# Altium schematic sheet [08] - DDR3 MEMORY.SchDoc
size A2; DocumentNumber: 8; SheetNumber: 8; SheetTotal: 13; NameAuthor: Angle Vu
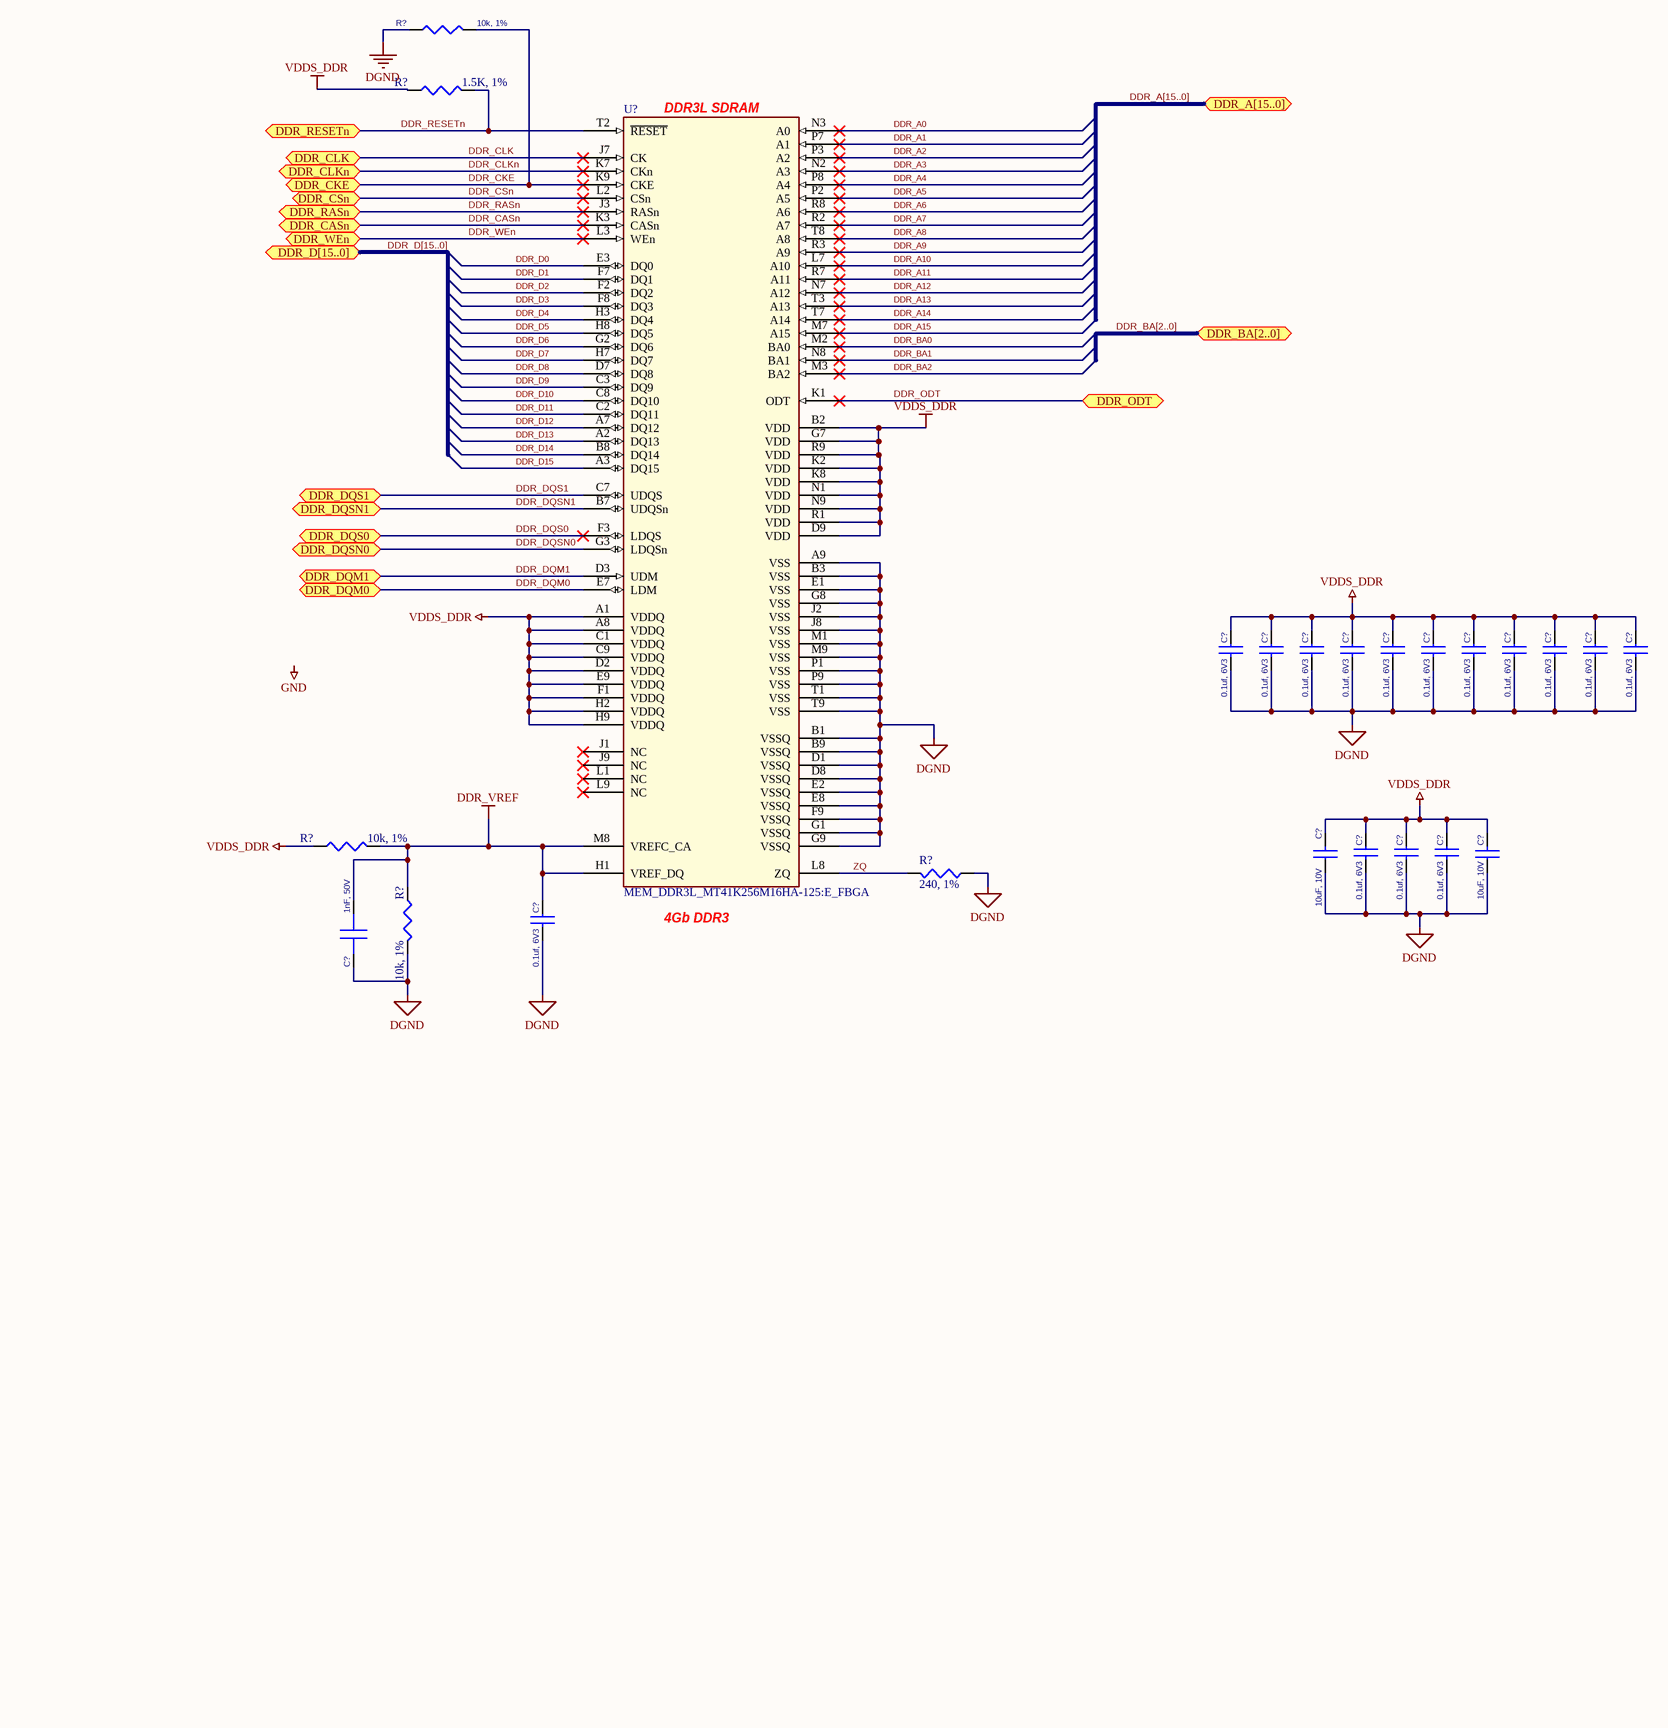
[diagram p0: [08] - DDR3 MEMORY.SchDoc]

## Parts
(Parts that share a designator on the sheet are numbered #1, #2 ... from top to bottom, then left to right.)
C?#1  0.1uf, 6V3  [402]
C?#2  0.1uf, 6V3  [402]
C?#3  0.1uf, 6V3  [402]
C?#4  0.1uf, 6V3  [402]
C?#5  0.1uf, 6V3  [402]
C?#6  0.1uf, 6V3  [402]
C?#7  0.1uf, 6V3  [402]
C?#8  0.1uf, 6V3  [402]
C?#9  0.1uf, 6V3  [402]
C?#10  0.1uf, 6V3  [402]
C?#11  0.1uf, 6V3  [402]
C?#12  0.1uf, 6V3  [402]
C?#13  0.1uf, 6V3  [402]
C?#14  0.1uf, 6V3  [402]
C?#15  10uF, 10V  [805]
C?#16  10uF, 10V  [805]
C?#17  1nF, 50V  [402]
C?#18  0.1uf, 6V3  [402]
R?#1  10k, 1%  [402]
R?#2  1.5K, 1%  [402]
R?#3  10k, 1%  [402]
R?#4  240, 1%  [402]
R?#5  10k, 1%  [402]
U?  MEM_DDR3L_MT41K256M16HA-125:E_FBGA

## Ports
DDR_A[15..0], DDR_BA[2..0], DDR_CASn, DDR_CKE, DDR_CLK, DDR_CLKn, DDR_CSn, DDR_D[15..0], DDR_DQM0, DDR_DQM1, DDR_DQS0, DDR_DQS1, DDR_DQSN0, DDR_DQSN1, DDR_ODT, DDR_RASn, DDR_RESETn, DDR_WEn

## Nets
DDR_VREF: C?#17.1 C?#18.1 R?#3.2 R?#5.1 U?.H1(VREF_DQ) U?.M8(VREFC_CA)
DGND: C?#1.2 C?#2.2 C?#3.2 C?#4.2 C?#5.2 C?#6.2 C?#7.2 C?#8.2 C?#9.2 C?#10.2 C?#11.2 C?#12.2 C?#13.2 C?#14.2 C?#15.1 C?#16.1 C?#17.2 C?#18.2 R?#1.1 R?#4.1 R?#5.2 U?.A9(VSS) U?.B1(VSSQ) U?.B3(VSS) U?.B9(VSSQ) U?.D1(VSSQ) U?.D8(VSSQ) U?.E1(VSS) U?.E2(VSSQ) U?.E8(VSSQ) U?.F9(VSSQ) U?.G1(VSSQ) U?.G8(VSS) U?.G9(VSSQ) U?.J2(VSS) U?.J8(VSS) U?.M1(VSS) U?.M9(VSS) U?.P1(VSS) U?.P9(VSS) U?.T1(VSS) U?.T9(VSS)
VDDS_DDR: C?#1.1 C?#2.1 C?#3.1 C?#4.1 C?#5.1 C?#6.1 C?#7.1 C?#8.1 C?#9.1 C?#10.1 C?#11.1 C?#12.1 C?#13.1 C?#14.1 C?#15.2 C?#16.2 R?#2.1 R?#3.1 U?.A1(VDDQ) U?.A8(VDDQ) U?.B2(VDD) U?.C1(VDDQ) U?.C9(VDDQ) U?.D2(VDDQ) U?.D9(VDD) U?.E9(VDDQ) U?.F1(VDDQ) U?.G7(VDD) U?.H2(VDDQ) U?.H9(VDDQ) U?.K2(VDD) U?.K8(VDD) U?.N1(VDD) U?.N9(VDD) U?.R1(VDD) U?.R9(VDD)
DDR_A0: U?.N3(A0)
DDR_A1: U?.P7(A1)
DDR_A2: U?.P3(A2)
DDR_A3: U?.N2(A3)
DDR_A4: U?.P8(A4)
DDR_A5: U?.P2(A5)
DDR_A6: U?.R8(A6)
DDR_A7: U?.R2(A7)
DDR_A8: U?.T8(A8)
DDR_A9: U?.R3(A9)
DDR_A10: U?.L7(A10)
DDR_A11: U?.R7(A11)
DDR_A12: U?.N7(A12)
DDR_A13: U?.T3(A13)
DDR_A14: U?.T7(A14)
DDR_A15: U?.M7(A15)
DDR_BA0: U?.M2(BA0)
DDR_BA1: U?.N8(BA1)
DDR_BA2: U?.M3(BA2)
DDR_CASn: U?.K3(CASn) ; port DDR_CASn
DDR_CKE: R?#1.2 U?.K9(CKE) ; port DDR_CKE
DDR_CLK: U?.J7(CK) ; port DDR_CLK
DDR_CLKn: U?.K7(CKn) ; port DDR_CLKn
DDR_CSn: U?.L2(CSn) ; port DDR_CSn
DDR_D0: U?.E3(DQ0)
DDR_D1: U?.F7(DQ1)
DDR_D2: U?.F2(DQ2)
DDR_D3: U?.F8(DQ3)
DDR_D4: U?.H3(DQ4)
DDR_D5: U?.H8(DQ5)
DDR_D6: U?.G2(DQ6)
DDR_D7: U?.H7(DQ7)
DDR_D8: U?.D7(DQ8)
DDR_D9: U?.C3(DQ9)
DDR_D10: U?.C8(DQ10)
DDR_D11: U?.C2(DQ11)
DDR_D12: U?.A7(DQ12)
DDR_D13: U?.A2(DQ13)
DDR_D14: U?.B8(DQ14)
DDR_D15: U?.A3(DQ15)
DDR_DQM0: U?.E7(LDM) ; port DDR_DQM0
DDR_DQM1: U?.D3(UDM) ; port DDR_DQM1
DDR_DQS0: U?.F3(LDQS) ; port DDR_DQS0
DDR_DQS1: U?.C7(UDQS) ; port DDR_DQS1
DDR_DQSN0: U?.G3(LDQSn) ; port DDR_DQSN0
DDR_DQSN1: U?.B7(UDQSn) ; port DDR_DQSN1
DDR_ODT: U?.K1(ODT) ; port DDR_ODT
DDR_RASn: U?.J3(RASn) ; port DDR_RASn
DDR_RESETn: R?#2.2 U?.T2(~{RESET}) ; port DDR_RESETn
DDR_WEn: U?.L3(WEn) ; port DDR_WEn
ZQ: R?#4.2 U?.L8(ZQ)

Not connected (* = marked no-connect by the designer): U? J1(NC)* J9(NC)* L1(NC)* L9(NC)*

## Buses and harness runs
bus DDR_A[15..0] = port DDR_A[15..0]
bus DDR_BA[2..0] = port DDR_BA[2..0]
bus DDR_D[15..0] = port DDR_D[15..0]

## Notes on the sheet
- (near U?) DDR3L SDRAM
- (near U?) 4Gb DDR3
- CLOCKS (CPU & PCIE)
- Labels drawn without touching a wire or pin: GND
- Designed By
- Checked By
- Page Name:
- Size:
- A2
- Company:
- Address:
- Sheet:
- /

## Library data of the parts
C?#1-C?#14 C?#18 = CAP_0.01uf_X7R_16V_10%_0402: CAP CER 0.1UF 6.3V 10% X5R 0402; Manufacturer: TDK Corporation; Manufacturer Part Number: C1005X5R0J104K050BA; Capacitance: 0.1µF; Supplier 1: Digi-Key; Supplier Part Number 1: 445-1266-6-ND; RoHS: RoHS Compliant; Category: Capacitors; Stock 1: 127604; Pricing 1: 1=0.1, 10=0.026, 100=0.0121, 250=0.00992, 500=0.00848, 1000=0.0066, 5000=0.0055 (USD); Voltage - Rated: 6.3V; Tolerance: ±10%; Temperature Coefficient: X5R; Mounting Type: Surface Mount, MLCC; Operating Temperature: -55°C ~ 85°C; Applications: General Purpose; Ratings: -; Package / Case: 0402 (1005 Metric); Size / Dimension: 0.039" L x 0.020" W (1.00mm x 0.50mm); Height - Seated (Max): -; Thickness (Max): 0.022" (0.55mm); Lead Spacing: -; Features: -; Packaging: Digi-Reel®; Lead Style: -; ComponentLink1URL: http://www.kemet.com/datasheets&C0402C104K4RACTU; ComponentLink1Description: http://www.kemet.com/datasheets&C0402C104K4RACTU
C?#15 C?#16 = CAP_4.7uF_X5R_6.3V_10%_0603: CAP CER 10UF 10V Y5V 0805; Manufacturer: TDK Corporation; Manufacturer Part Number: C2012Y5V1A106Z; Capacitance: 10µF; Tolerance: -20%, +80%; Temperature Coefficient: Y5V (F); Supplier 1: Digi-Key; Supplier Part Number 1: 445-1371-6-ND; RoHS: RoHS Compliant; Category: Capacitors; Stock 1: 102071; Pricing 1: 1=0.15, 10=0.105, 100=0.0499, 250=0.042, 500=0.03518, 1000=0.02887 (USD); Voltage - Rated: 10V; Mounting Type: Surface Mount, MLCC; Operating Temperature: -30°C ~ 85°C; Applications: General Purpose; Ratings: -; Package / Case: 0805 (2012 Metric); Size / Dimension: 0.079" L x 0.049" W (2.00mm x 1.25mm); Height - Seated (Max): -; Thickness (Max): 0.057" (1.45mm); Lead Spacing: -; Features: -; Packaging: Digi-Reel®; Lead Style: -; ComponentLink1URL: http://media.digikey.com/pdf/Data%20Sheets/TDK%20PDFs/C_Series_GeneralAppl_B11.pdf; ComponentLink1Description: http://media.digikey.com/pdf/Data%20Sheets/TDK%20PDFs/C_Series_GeneralAppl_B11.pdf
C?#17 = CAP SMD: CAP CER 1000PF 16V 10% X7R 0402; Manufacturer: Yageo; Manufacturer Part Number: CC0402KRX7R7BB102; Supplier 1: Digi-Key; Supplier Part Number 1: 311-1352-6-ND; RoHS: RoHS Compliant; Category: Capacitors; Stock 1: 391222; Pricing 1: 1=0.1, 10=0.012, 25=0.0088, 100=0.0057, 250=0.00464, 500=0.00396, 1000=0.00309, 2500=0.00278, 5000=0.00258 (USD); Capacitance: 1000pF; Voltage - Rated: 16V; Tolerance: ±10%; Temperature Coefficient: X7R; Mounting Type: Surface Mount, MLCC; Operating Temperature: -55°C ~ 125°C; Applications: General Purpose; Ratings: -; Package / Case: 0402 (1005 Metric); Size / Dimension: 0.039" L x 0.020" W (1.00mm x 0.50mm); Height - Seated (Max): -; Thickness (Max): 0.022" (0.55mm); Lead Spacing: -; Features: -; Packaging: Digi-Reel®; Lead Style: -; ComponentLink1URL: http://www.yageo.com/documents/recent/UPY-GPHC_X7R_6.3V-to-50V_8.pdf; ComponentLink1Description: http://www.yageo.com/documents/recent/UPY-GPHC_X7R_6.3V-to-50V_8.pdf
R?#1 R?#3 R?#5 = RES_10K_1/16W_1%_0402: RES 10K OHM 1/16W 5% 0402 SMD; Manufacturer: Rohm Semiconductor; Manufacturer Part Number: MCR01MZPJ103; Power (Watts): 0.063W, 1/16W; Temperature Coefficient: ±200ppm/°C; Category: Resistors; ComponentLink1Description: http://rohmfs.rohm.com/en/products/databook/datasheet/passive/resistor/chip_resistor/mcr_a.pdf; ComponentLink1URL: http://rohmfs.rohm.com/en/products/databook/datasheet/passive/resistor/chip_resistor/mcr_a.pdf; Composition: Thick Film; Features: Automotive AEC-Q200 Qualified; Height: 0.016" (0.40mm); Number of Terminations: 2; Package / Case: 0402 (1005 Metric); Packaging: Digi-Reel®; Pricing 1: 1=0.1, 10=0.019, 25=0.014, 100=0.0078, 250=0.00596, 500=0.00476, 1000=0.0035, 5000=0.00251 (USD); Resistance (Ohms): 10k; RoHS: RoHS Compliant; Size / Dimension: 0.039" L x 0.020" W (1.00mm x 0.50mm); Stock 1: 110842; Supplier 1: Digi-Key; Supplier Device Package: 0402 (1005 Metric); Supplier Part Number 1: RHM10KJDKR-ND; Tolerance: ±5%
R?#2 = RES_10K_1/16W_1%_0402: RES 1.50K OHM 1/16W 1% 0402 SMD; Manufacturer: Yageo; Manufacturer Part Number: RC0402FR-071K5L; Power (Watts): 0.063W, 1/16W; Temperature Coefficient: ±100ppm/°C; Supplier 1: Digi-Key; Supplier Part Number 1: 311-1.50KLRDKR-ND; RoHS: RoHS Compliant; Category: Resistors; Stock 1: 433921; Pricing 1: 1=0.1, 10=0.014, 25=0.0104, 100=0.0063, 250=0.0054, 500=0.00382, 1000=0.0027, 2500=0.00234, 5000=0.00203 (USD); Resistance (Ohms): 1.5k; Composition: Thick Film; Features: -; Tolerance: ±1%; Package / Case: 0402 (1005 Metric); Supplier Device Package: 0402; Size / Dimension: 0.039" L x 0.020" W (1.00mm x 0.50mm); Height: 0.016" (0.40mm); Number of Terminations: 2; Packaging: Digi-Reel®; ComponentLink1URL: http://www.yageo.com/documents/recent/PYu-RC0402_51_RoHS_L_6.pdf; ComponentLink1Description: http://www.yageo.com/documents/recent/PYu-RC0402_51_RoHS_L_6.pdf
R?#4 = RES_10K_1/16W_1%_0402: RES 240 OHM 1/10W 5% 0402 SMD; Manufacturer: Yageo; Manufacturer Part Number: RC0402FR-07240RL; Resistance (Ohms): 240; Power (Watts): 0.063W, 1/16W; Temperature Coefficient: ±100ppm/°C; Supplier 1: Digi-Key; Supplier Part Number 1: 311-240LRDKR-ND; RoHS: RoHS Compliant; Category: Resistors; Stock 1: 39100; Pricing 1: 1=0.1, 10=0.014, 25=0.0104, 100=0.0063, 250=0.0054, 500=0.00382, 1000=0.0027, 2500=0.00234, 5000=0.00203 (USD); Composition: Thick Film; Features: -; Tolerance: ±1%; Package / Case: 0402 (1005 Metric); Supplier Device Package: 0402; Size / Dimension: 0.039" L x 0.020" W (1.00mm x 0.50mm); Height: 0.016" (0.40mm); Number of Terminations: 2; Packaging: Digi-Reel®; ComponentLink1URL: http://www.yageo.com/documents/recent/PYu-RC0402_51_RoHS_L_6.pdf; ComponentLink1Description: http://www.yageo.com/documents/recent/PYu-RC0402_51_RoHS_L_6.pdf
U? = MEM_DDR3L_MT41K256M16HA-125:E_FBGA: IC DDR3 SDRAM 4GBIT 800MHZ FBGA; Manufacturer: Micron Technology Inc.; Format - Memory: RAM; Memory Type: DDR3L SDRAM; Memory Size: 4G (256M x16); Interface: Parallel; Voltage - Supply: 1.283 V ~ 1.45 V; Supplier 1: Digi-Key; Manufacturer Part Number: MT41K256M16HA-125:E; RoHS: RoHS Compliant; Category: Integrated Circuits (ICs); Stock 1: 0; Pricing 1: 1000=0 (USD); Packaging: Tray; Part Status: Obsolete; Speed: 800MHz; Operating Temperature: 0°C ~ 95°C (TC); Package / Case: 96-TFBGA; Supplier Device Package: 96-FBGA (9x14); ComponentLink1URL: http://www.micron.com/~/media/Documents/Products/Data%20Sheet/DRAM/DDR3/4Gb_1_35V_DDR3L.pdf; ComponentLink1Description: http://www.micron.com/~/media/Documents/Products/Data%20Sheet/DRAM/DDR3/4Gb_1_35V_DDR3L.pdf; Supplier Part Number 1: MT41K256M16HA-125:E-ND